# EAGLE design DACBRDV2 (EAGLE 5.07)
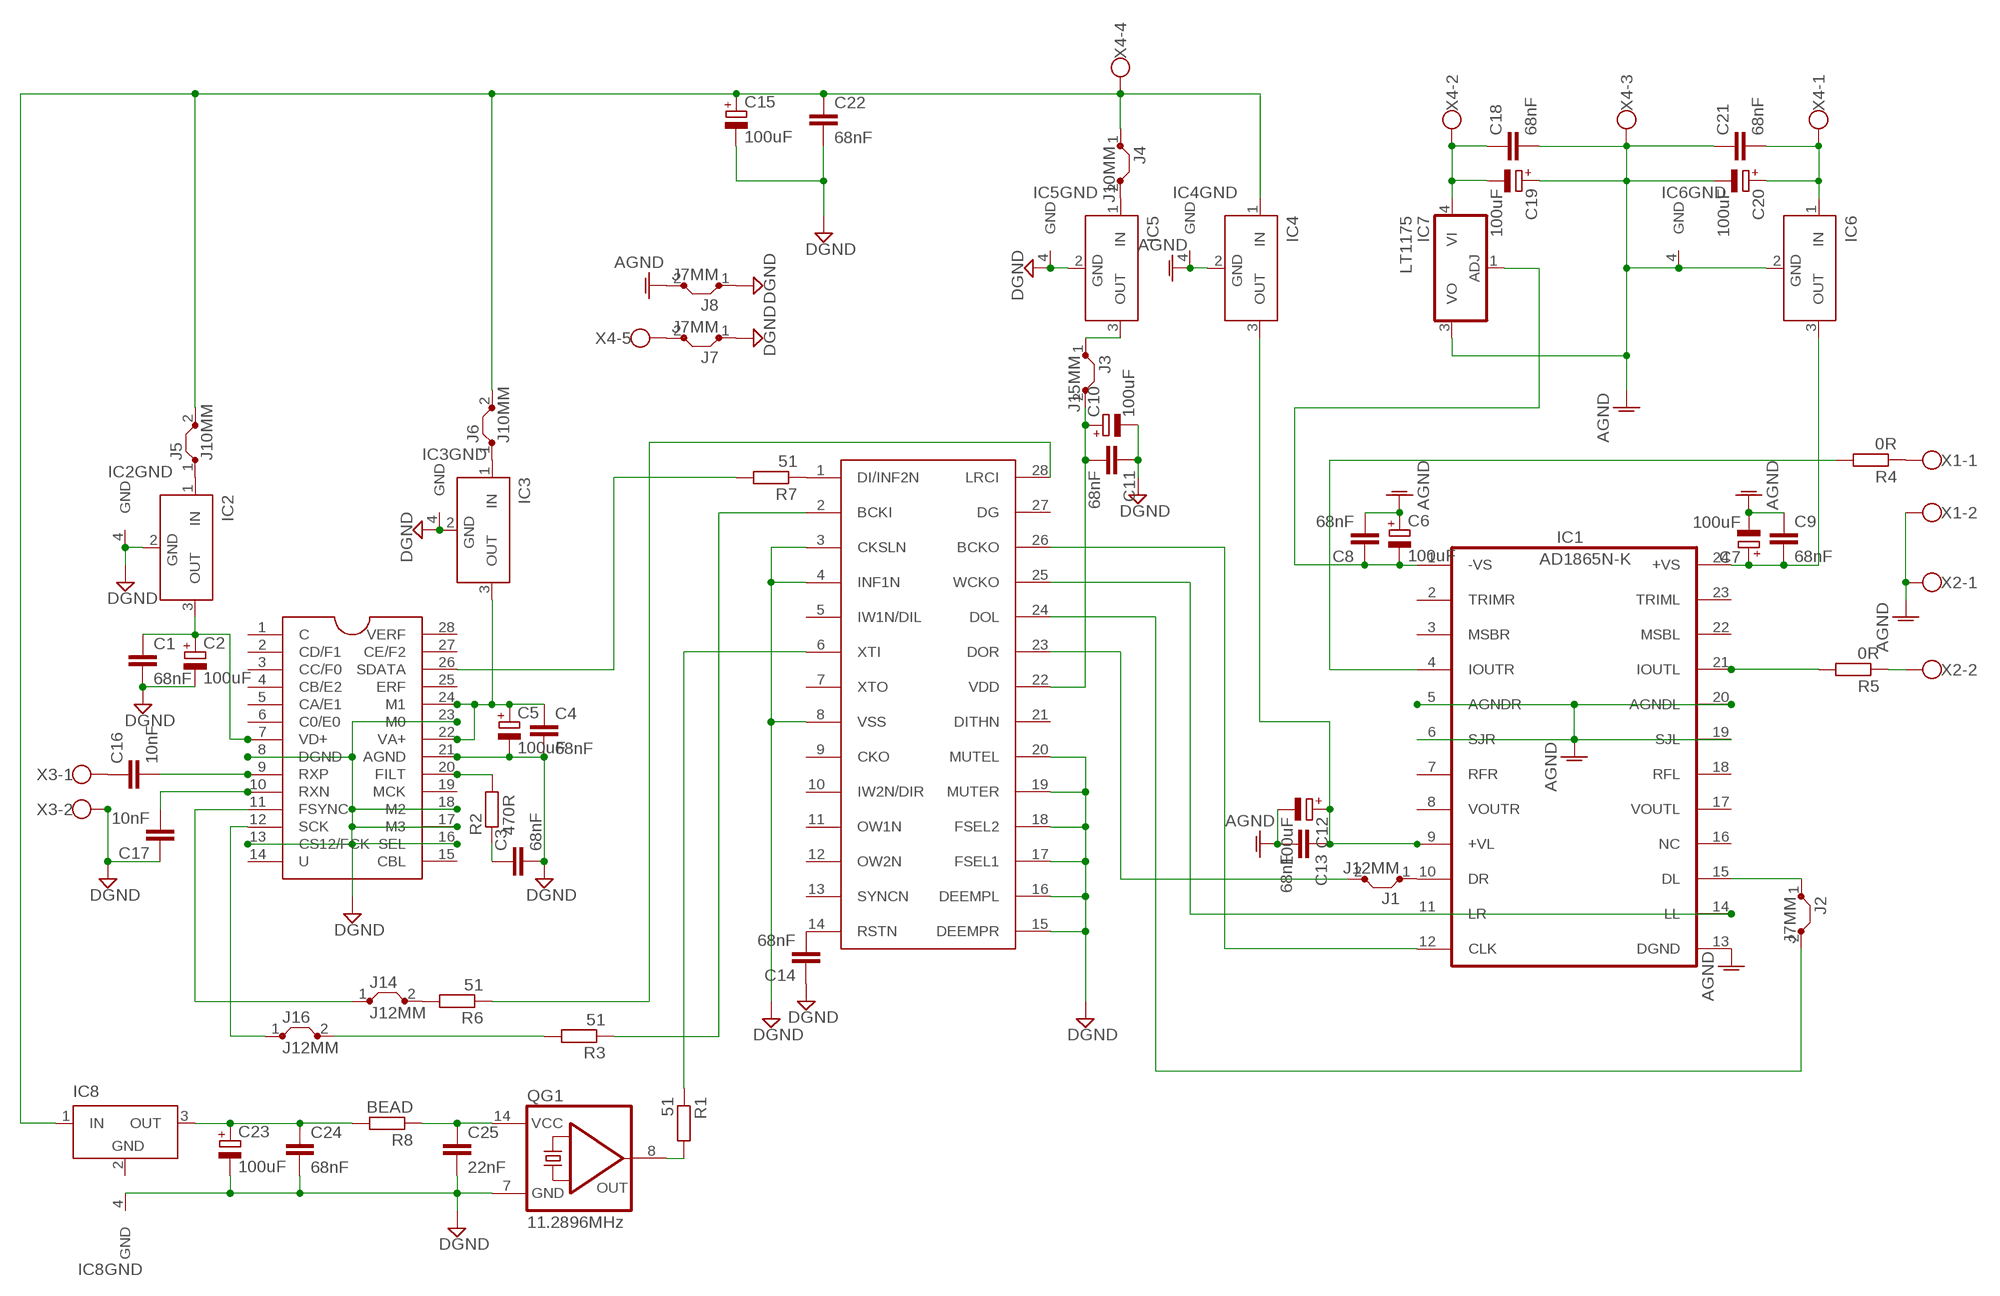
[diagram p0: schematic, sheet 1]

## Parts
C1  68nF  C-EU050-035X075  [C050-035X075]
C2  100uF  CPOL-EUE5-10.5  [E5-10,5]
C3  68nF  C-EU050-075X075  [C050-075X075]
C4  68nF  C-EU050-035X075  [C050-035X075]
C5  100uF  CPOL-EUE5-10.5  [E5-10,5]
C6  100uF  CPOL-EUE5-10.5  [E5-10,5]
C7  100uF  CPOL-EUE5-10.5  [E5-10,5]
C8  68nF  C-EU050-035X075  [C050-035X075]
C9  68nF  C-EU050-035X075  [C050-035X075]
C10  100uF  CPOL-EUE5-10.5  [E5-10,5]
C11  68nF  C-EU050-035X075  [C050-035X075]
C12  100uF  CPOL-EUE5-10.5  [E5-10,5]
C13  68nF  C-EU050-035X075  [C050-035X075]
C14  68nF  C-EU050-035X075  [C050-035X075]
C15  100uF  CPOL-EUE5-10.5  [E5-10,5]
C16  10nF  C-EU050-055X075  [C050-055X075]
C17  10nF  C-EU050-055X075  [C050-055X075]
C18  68nF  C-EU050-035X075  [C050-035X075]
C19  100uF  CPOL-EUE5-10.5  [E5-10,5]
C20  100uF  CPOL-EUE5-10.5  [E5-10,5]
C21  68nF  C-EU050-035X075  [C050-035X075]
C22  68nF  C-EU050-035X075  [C050-035X075]
C23  100uF  CPOL-EUE5-10.5  [E5-10,5]
C24  68nF  C-EU050-035X075  [C050-035X075]
C25  22nF  C-EU050-035X075  [C050-035X075]
IC1  AD1865N-K  AD1865  [DIL24-6]
IC2  LT1129CST5  [SOT223]
IC3  LT1129CST5  [SOT223]
IC4  LT1129CST5  [SOT223]
IC5  LT1129CST5  [SOT223]
IC6  LT1129CST5  [SOT223]
IC7  LT1175  337IMP  [SOT223]
IC8  LT1129CST5  [SOT223]
J1  J12MM  [12]
J2  J7MM  [07]
J3  J15MM  [15]
J4  J10MM  [10]
J5  J10MM  [10]
J6  J10MM  [10]
J7  J7MM  [07]
J8  J7MM  [07]
J14  J12MM  [12]
J16  J12MM  [12]
QG1  11.2896MHz  QG5860  [DIL14S]
R1  51  R-EU_0204/7  [0204/7]
R2  470R  R-EU_0204/7  [0204/7]
R3  51  R-EU_0204/7  [0204/7]
R4  0R  R-EU_0309/12  [0309/12]
R5  0R  R-EU_0309/12  [0309/12]
R6  51  R-EU_0207/12  [0207/12]
R7  51  R-EU_0207/12  [0207/12]
R8  BEAD  R-EU_0309/12  [0309/12]
U$1  CS8414  CS8414DIP  [DIL28]
U$2  SM5842  [DIL28]
X1  W237-02P  [W237-132]
X2  W237-02P  [W237-132]
X3  W237-02P  [W237-132]
X4  W237-05P  [W237-5P]

## Nets
AGND: C6.+ C7.- C8.2 C9.1 C12.- C13.2 C18.2 C19.+ C20.- C21.1 IC1.5(AGNDR) IC1.6(SJR) IC1.13(DGND) IC1.19(SJL) IC1.20(AGNDL) IC4.2(GND) IC4.4(GND) IC6.2(GND) IC6.4(GND) IC7.3(VO) J8.2 X1.2 X2.1 X4.3
DGND: C1.2 C2.- C3.2 C4.2 C5.- C10.- C11.1 C14.1 C15.- C17.1 C22.2 C23.- C24.2 C25.2 IC2.2(GND) IC2.4(GND) IC3.2(GND) IC3.4(GND) IC5.2(GND) IC5.4(GND) IC8.4(GND) J7.1 J8.1 QG1.7(GND) U$1.8(DGND) U$1.13(CS12/FCK) U$1.16(SEL) U$1.17(M3) U$1.18(M2) U$1.21(AGND) U$1.23(M0) U$2.3(CKSLN) U$2.4(INF1N) U$2.8(VSS) U$2.15(DEEMPR) U$2.16(DEEMPL) U$2.17(FSEL1) U$2.18(FSEL2) U$2.19(MUTER) U$2.20(MUTEL) X3.2
N$1: R2.2 U$1.20(FILT)
N$2: IC1.11(LR) IC1.14(LL) U$2.25(WCKO)
N$3: C3.1 R2.1
N$5: C7.+ C9.2 IC1.24(+VS) IC6.3(OUT)
N$6: C10.+ C11.2 J3.2 U$2.22(VDD)
N$7: IC1.10(DR) J1.1
N$8: IC1.15(DL) J2.1
N$9: IC5.3(OUT) J3.1
N$10: IC5.1(IN) J4.2
N$11: J1.2 U$2.23(DOR)
N$12: J2.2 U$2.24(DOL)
N$14: IC1.12(CLK) U$2.26(BCKO)
N$15: C6.- C8.1 IC1.1(-VS) IC7.1(ADJ)
N$16: C15.+ C22.1 IC4.1(IN) IC8.1(IN) J4.1 J5.2 J6.2 X4.4
N$17: IC2.1(IN) J5.1
N$18: IC1.21(IOUTL) R5.2
N$19: R7.2 U$1.26(SDATA)
N$20: IC1.4(IOUTR) R4.2
N$21: R5.1 X2.2
N$22: R4.1 X1.1
N$23: C17.2 U$1.10(RXN)
N$24: C16.2 U$1.9(RXP)
N$25: C16.1 X3.1
N$26: C12.+ C13.1 IC1.9(+VL) IC4.3(OUT)
N$27: R7.1 U$2.1(DI/INF2N)
N$28: R1.1 U$2.6(XTI)
N$29: C25.1 QG1.14(VCC) R8.1
N$30: IC3.1(IN) J6.1
N$31: R3.1 U$2.2(BCKI)
N$32: C4.1 C5.+ IC3.3(OUT) U$1.22(VA+) U$1.24(M1)
N$33: J14.1 U$1.11(FSYNC)
N$34: J16.1 U$1.12(SCK)
N$35: R6.1 U$2.28(LRCI)
N$36: J16.2 R3.2
N$37: C14.2 U$2.14(RSTN)
N$38: J14.2 R6.2
N$39: C1.1 C2.+ IC2.3(OUT) U$1.7(VD+)
N$40: C18.1 C19.- IC7.4(VI) X4.2
N$41: QG1.8(OUT) R1.2
N$44: J7.2 X4.5
N$45: C20.+ C21.2 IC6.1(IN) X4.1
N$47: C23.+ C24.1 IC8.3(OUT) R8.2
Unconnected: IC1.2(TRIMR) IC1.3(MSBR) IC1.7(RFR) IC1.8(VOUTR) IC1.16(NC) IC1.17(VOUTL) IC1.18(RFL) IC1.22(MSBL) IC1.23(TRIML) U$1.1(C) U$1.2(CD/F1) U$1.3(CC/F0) U$1.4(CB/E2) U$1.5(CA/E1) U$1.6(C0/E0) U$1.14(U) U$1.15(CBL) U$1.19(MCK) U$1.25(ERF) U$1.27(CE/F2) U$1.28(VERF) U$2.5(IW1N/DIL) U$2.7(XTO) U$2.9(CKO) U$2.10(IW2N/DIR) U$2.11(OW1N) U$2.12(OW2N) U$2.13(SYNCN) U$2.21(DITHN) U$2.27(DG)

## Power pins joined to a net without a drawn wire
GND: IC8.2(GND)

## Library data of the parts
C1 C3 C4 C8 C9 C11 C13 C14 C16-C18 C21 C22 C24 C25 = resistor:C-EU: CAPACITOR, European symbol
C2 C5-C7 C10 C12 C15 C19 C20 C23 = resistor:CPOL-EU: POLARIZED CAPACITOR, European symbol
IC1 = pavouk:AD1865: Complete Dual 18-Bit 16xFS Audio DAC
IC2-IC6 IC8 = linear-technology:LT1129CST5: VOLTAGE REGULATOR with shutdown
IC7 = linear:*337: Negative VOLTAGE REGULATOR
J1-J8 J14 J16 = jumper:J: Bridge
QG1 = crystal:QG5860: CRYSTAL RESONATOR
R1-R8 = resistor:R-EU_: RESISTOR, European symbol
U$1 = cirrus-dar:CS8414: 24bit 96kHz Digital Audio Receiver
U$2 = burr-brown:SM5842
X1-X3 = con-wago-508:W237-02P: WAGO SREW CLAMP
X4 = con-wago-508:W237-05P: WAGO SREW CLAMP

## Board
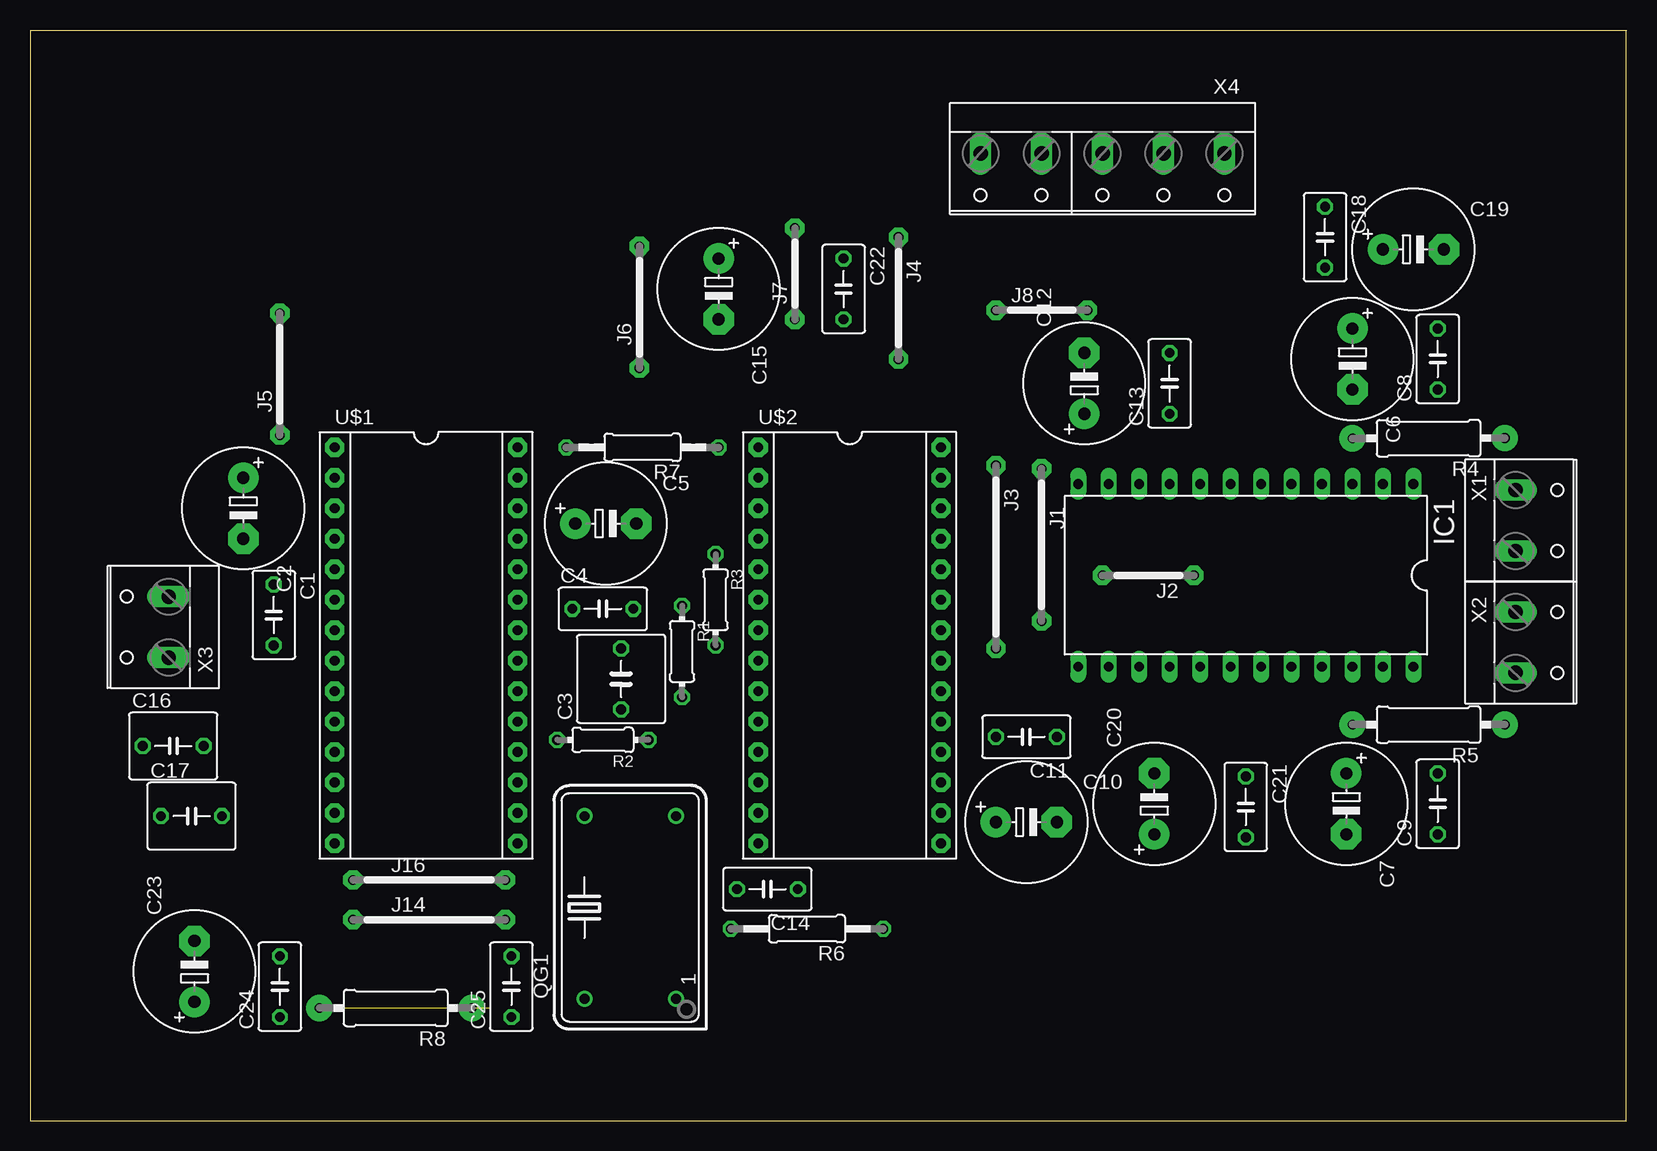
[diagram p1: board, top side]
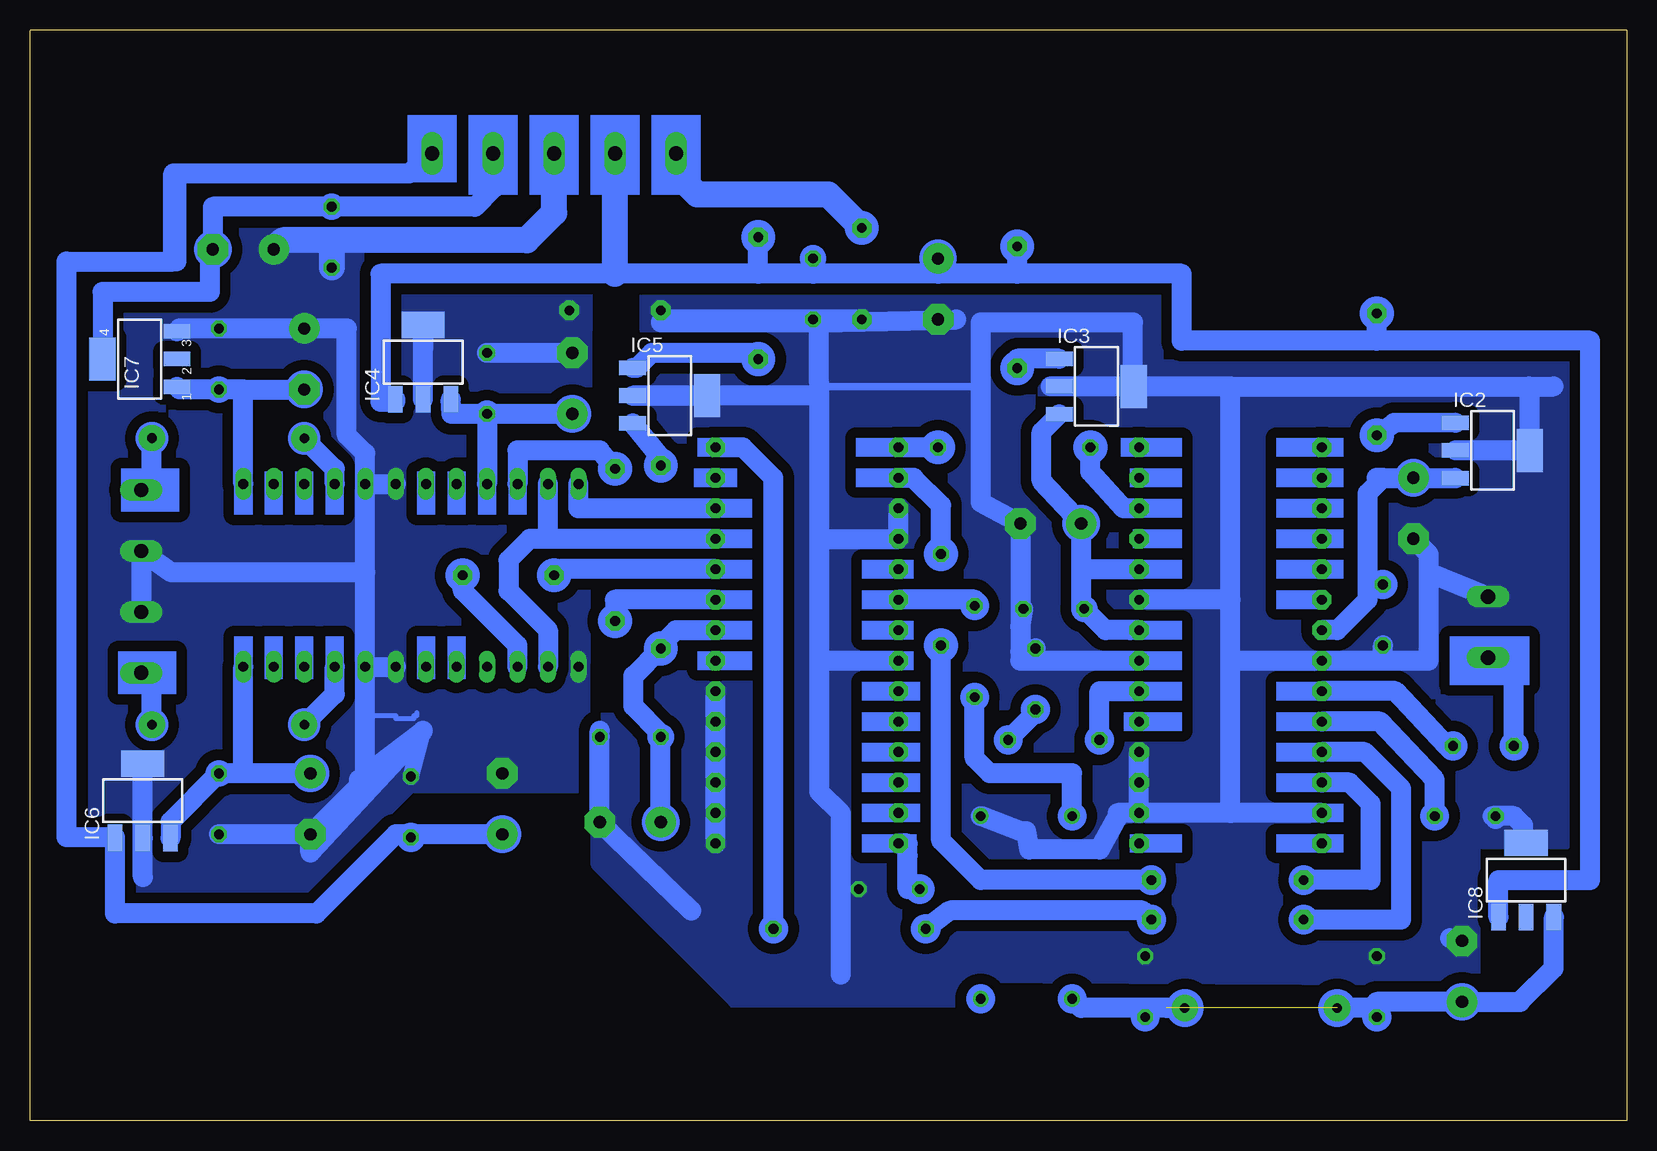
[diagram p2: board, bottom side, seen from below]

Size 133.1 x 90.93 mm. Coordinates in mm from the lower left corner, seen from the top.
Outline: 133.08,90.86 133.08,0 0,0 0,90.93 133.1,90.93
Copper layers (2*16): Route2 0.035mm / dielectric 0.15mm / Bottom 0.035mm
Design rules "default *": minimum track width 10mil, minimum drill 24mil, track to track 8mil, track to pad 8mil, pad to pad 8mil, via to via 8mil, smd to smd 8mil, copper to edge 40mil, drill to drill 8mil, minimum pad ring 10mil, minimum via ring 8mil, stop-mask expansion 4mil, vias tented up to drill 0mil, thermal gap 10mil

### Footprints (pad centres in the part's own frame; a part is rotated, then mirrored left to right if it is on the bottom)
C050-035X075 = drill 0.813 octagon: 1 -2.54,0; 2 2.54,0
E5-10,5 = drill 1.016 pad 2.54 round: + -2.54,0 | drill 1.016 pad 2.54 octagon: - 2.54,0
C050-075X075 = drill 0.813 octagon: 1 -2.54,0; 2 2.54,0
C050-055X075 = drill 0.813 octagon: 1 -2.54,0; 2 2.54,0
DIL24-6 = drill 0.813 long: 1 -13.97,-7.62; 2 -11.43,-7.62; 3 -8.89,-7.62; 4 -6.35,-7.62; 5 -3.81,-7.62; 6 -1.27,-7.62; 7 1.27,-7.62; 8 3.81,-7.62; 9 6.35,-7.62; 10 8.89,-7.62; 11 11.43,-7.62; 12 13.97,-7.62; 13 13.97,7.62; 14 11.43,7.62; 15 8.89,7.62; 16 6.35,7.62; 17 3.81,7.62; 18 1.27,7.62; 19 -1.27,7.62; 20 -3.81,7.62; 21 -6.35,7.62; 22 -8.89,7.62; 23 -11.43,7.62; 24 -13.97,7.62
SOT223 = smd 1.219 x 2.235: 1 -2.311,-3.099; 2 0,-3.099; 3 2.311,-3.099 | smd 3.6 x 2.2: 4 0,3.099
12 = drill 0.813 pad 1.6 octagon: 1 -6.35,0; 2 6.35,0
07 = drill 0.813 pad 1.6 octagon: 1 -3.81,0; 2 3.81,0
15 = drill 0.813 pad 1.6 octagon: 1 -7.62,0; 2 7.62,0
10 = drill 0.813 pad 1.6 octagon: 1 -5.08,0; 2 5.08,0
DIL14S = drill 0.813 round: 1 -7.62,-3.81; 7 7.62,-3.81; 8 7.62,3.81; 14 -7.62,3.81
0204/7 = drill 0.813 octagon: 1 -3.81,0; 2 3.81,0
0309/12 = drill 0.8 pad 2.184 round: 1 -6.35,0; 2 6.35,0
0207/12 = drill 0.813 octagon: 1 -6.35,0; 2 6.35,0
DIL28 = drill 0.813 pad 1.6 octagon: 1 -16.51,-7.62; 2 -13.97,-7.62; 3 -11.43,-7.62; 4 -8.89,-7.62; 5 -6.35,-7.62; 6 -3.81,-7.62; 7 -1.27,-7.62; 8 1.27,-7.62; 9 3.81,-7.62; 10 6.35,-7.62; 11 8.89,-7.62; 12 11.43,-7.62; 13 13.97,-7.62; 14 16.51,-7.62; 15 16.51,7.62; 16 13.97,7.62; 17 11.43,7.62; 18 8.89,7.62; 19 6.35,7.62; 20 3.81,7.62; 21 1.27,7.62; 22 -1.27,7.62; 23 -3.81,7.62; 24 -6.35,7.62; 25 -8.89,7.62; 26 -11.43,7.62; 27 -13.97,7.62; 28 -16.51,7.62
W237-132 = drill 1.194 long: 1 -2.54,-0.635; 2 2.54,-0.635
W237-5P = drill 1.194 long: 1 -10.16,-0.635; 2 -5.08,-0.635; 3 0,-0.635; 4 5.08,-0.635; 5 10.16,-0.635

### Placement (x,y rotation side)
C1  20.32,42.16 270 top
C2  17.78,51.05 270 top
C3  49.28,36.83 90 top
C4  47.75,42.67 0 top
C5  48.01,49.78 0 top
C6  110.24,63.5 270 top
C7  109.73,26.42 270 top
C8  117.35,63.5 90 top
C9  117.35,26.42 90 top
C10  83.06,24.89 0 top
C11  83.06,32 180 top
C12  87.88,61.47 90 top
C13  95,61.47 90 top
C14  61.47,19.3 180 top
C15  57.4,69.34 270 top
C16  11.94,31.24 0 top
C17  13.46,25.4 0 top
C18  107.95,73.66 270 top
C19  115.32,72.64 0 top
C20  93.73,26.42 90 top
C21  101.35,26.16 270 top
C22  67.82,69.34 270 top
C23  13.72,12.45 90 top
C24  20.83,11.18 90 top
C25  40.13,11.18 90 top
IC1  101.35,45.47 180 top
IC2  11.18,55.88 270 bottom
IC3  44.2,61.21 270 bottom
IC4  100.33,63.25 0 bottom
IC5  79.76,60.45 270 bottom
IC6  123.7,26.67 0 bottom
IC7  123.95,63.5 90 bottom
IC8  8.38,20.07 0 bottom
J1  84.33,48.01 270 top
J2  93.22,45.47 180 top
J3  80.52,46.99 270 top
J4  72.39,68.58 270 top
J5  20.83,62.23 90 top
J6  50.8,67.82 90 top
J7  63.75,70.61 90 top
J8  84.33,67.56 0 top
J14  33.27,16.76 0 top
J16  33.27,20.07 0 top
QG1  50.04,17.78 90 top
R1  54.36,39.12 270 top
R2  47.75,31.75 180 top
R3  57.15,43.43 270 top
R4  116.59,56.9 180.1 top
R5  116.59,33.02 180 top
R6  64.77,16 180 top
R7  51.05,56.13 180 top
R8  30.48,9.4 180 top
U$1  33.02,39.62 270 top
U$2  68.33,39.62 270 top
X1  124.46,50.04 270 top
X2  124.46,39.88 270 top
X3  10.92,41.15 90 top
X4  89.41,80.01 180 top

### Tracks (layer width: path | path; a pad name or v marks a point on that pad's centre or on a via)
AGND
  Bottom 0.406: 100.84,34.04 100.84,33.78 101.09,33.78 101.09,33.53 102.62,33.53 102.62,33.78 105.16,33.78 105.66,33.78
  Bottom 1.422: C21.1 100.33,32.51
  Bottom 1.676: IC1.5 IC1.6 | IC1.20 105.16,45.72 | 105.16,45.72 IC1.5 | IC1.20 IC1.19 | IC1.5 105.16,55.63 106.68,57.15 106.68,66.04 C6.+ C8.2 120.62,66.04 IC7.3 | C7.- C9.1 | X2.1 X1.2 121.28,45.72 105.16,45.72 | 105.16,28.45 C7.- | 105.16,28.45 105.16,33.78 IC1.20 | IC6.4 IC6.2 123.7,20.32 | C7.- 109.73,22.35 100.33,32.51 105.66,28.45 105.16,28.45 | C12.- C13.2 | IC4.2 IC4.4 100.33,64.26
  Bottom 2.184: X4.3 89.41,75.69 91.69,73.41 107.95,73.41 | 107.95,73.41 C18.2 | C19.+ 112.01,73.41 107.95,73.41
  pour Bottom (isolate 0.889, no thermals): 86.61,69.6 86.61,69.34 86.87,27.69 101.35,27.69 109.73,19.3 128.27,19.3 128.78,74.17 105.66,74.17 105.66,69.85
DGND
  Bottom 0.61: 53.85,61.21 67.06,61.21 67.31,61.47
  Bottom 1.676: 33.02,25.65 33.02,38.35 | 33.02,25.65 U$1.16 | U$1.16 U$1.17 U$1.18 | U$1.13 33.02,25.65 | 33.02,38.35 U$1.8 20.32,38.35 | 20.32,38.35 C1.2 | 16.51,45.72 16.51,38.35 20.32,38.35 | 16.51,45.72 X3.2 | C2.- 16.51,47.24 16.51,45.72 | U$2.15 U$2.16 U$2.17 U$2.18 U$2.19 U$2.20 | 67.31,38.35 U$2.8 | U$1.16 42.42,25.65 42.42,25.4 43.94,22.61 49.78,22.61 50.04,24.13 50.55,24.13 QG1.7 | 67.31,48.51 67.31,38.35 | 67.31,48.51 U$2.4 U$2.3 | 67.31,38.35 67.31,27.43 65.53,25.65 65.53,12.19 | 77.98,17.53 C10.- C11.1 85.6,32.51 | 67.31,60.45 67.31,48.51 | 67.31,60.45 67.31,61.47 67.31,66.55 | 50.55,39.12 C3.2 | 50.55,41.15 C4.2 | 50.55,41.15 C5.- 53.85,51.56 53.85,61.21 53.85,66.55 41.15,66.55 41.15,61.21 | 50.55,41.15 50.55,39.12 | 50.55,39.12 50.55,38.35 U$1.21 | 67.31,66.55 67.56,66.55 | IC5.4 IC5.2 67.31,60.45 | IC2.4 8.13,55.88 | 8.13,55.88 IC2.2 | 8.13,55.88 8.25,55.75 | 33.02,43.43 33.02,61.21 | 33.02,38.35 33.02,43.43 | 8.13,61.21 8.13,55.12 | 33.02,61.21 8.13,61.21 | 8.13,61.21 6.1,61.21 | 33.02,61.21 41.15,61.21 | 41.15,61.21 48.01,61.21 | 67.31,66.55 55.88,66.8 | 67.56,66.55 80.52,66.55 | 67.56,66.55 C22.2 | C15.- 57.15,66.8 | J7.1 79.76,66.8 | 33.02,43.43 U$1.23 | IC8.4 8.64,23.42 8.64,24.64 9.4,25.4 C17.1 | C17.1 11.18,25.4 10.92,25.15 C17.1 | C23.- 14.73,15.24
  pour Bottom (isolate 0.889, rank 5, no thermals): 5.08,62.99 5.08,23.11 12.7,23.11 12.7,11.68 55.88,11.94 55.88,9.91 74.42,9.91 85.85,21.34 85.85,33.53 81.53,33.53 81.79,68.83 39.12,68.58 39.12,62.99
N$1
  Bottom 1.676: U$1.20 43.94,35.81 R2.2
N$2
  Bottom 1.676: U$2.25 89.92,48.51 | 89.92,48.51 IC1.11 | IC1.14 89.92,40.89 93.22,44.2 93.22,46.74 91.44,48.51 89.92,48.51
N$3
  Bottom 1.676: C3.1 49.28,34.04 R2.1
N$5
  Bottom 1.676: C7.+ 115.32,28.96 | 115.32,28.96 C9.2 121.39,24.92 IC6.3 | 115.32,28.96 IC1.24
N$6
  Bottom 1.676: C10.+ C11.2 80.52,32.26 82.8,34.54 82.8,37.08 J3.2 80.52,39.62 79.25,40.89 U$2.22
N$7
  Bottom 1.676: IC1.10 92.46,55.88 85.6,55.88 J1.1
N$8
  Bottom 1.676: IC1.15 92.46,39.62 97.03,44.2 J2.1
N$9
  Bottom 1.676: IC5.3 80.52,55.3 J3.1
N$10
  Bottom 1.676: J4.2 72.9,64.01 81.28,64.01 82.53,62.76 IC5.1
N$11
  Bottom 1.676: U$2.23 84.33,43.43 J1.2
N$12
  Bottom 1.676: U$2.24 88.9,45.97 J2.2
N$14
  Bottom 1.676: U$2.26 87.38,51.05 IC1.12
N$15
  Bottom 1.676: IC1.1 115.32,60.96 | 115.32,60.96 C8.1 120.62,60.96 IC7.1 | 115.32,60.96 C6.-
N$16
  Bottom 1.676: 20.83,65.02 J5.2 | 20.83,65.02 37.08,65.02 37.08,70.61 50.8,70.61 | 50.8,70.61 57.4,70.61 | 57.4,70.61 67.82,70.61 | 67.82,70.61 72.39,70.61 | 72.39,70.61 84.33,70.61 103.89,70.61 103.89,59.94 102.64,59.97 IC4.1 | 50.8,70.61 J6.2 | 72.39,70.61 J4.1 | 57.4,70.61 C15.+ | 67.82,70.61 C22.1 | 20.83,65.02 3.05,65.02 3.05,20.07 10.69,20.07 IC8.1
  Bottom 2.184: 84.33,70.61 X4.4
N$17
  Bottom 1.676: IC2.1 19.38,58.17 J5.1
N$18
  Bottom 1.676: R5.2 107.7,35.56 IC1.21
N$19
  Bottom 1.676: U$1.26 41.91,51.05 44.7,54.1 R7.2
N$20
  Bottom 1.676: IC1.4 107.7,54.34 R4.2
N$21
  Bottom 1.676: R5.1 122.94,37.21 X2.2
N$22
  Bottom 1.676: R4.1 122.94,52.7 X1.1
N$23
  Bottom 1.676: U$1.10 20.57,33.27 16,28.45 C17.2
N$24
  Bottom 1.676: U$1.9 19.3,35.81 14.99,31.24 C16.2
N$25
  Bottom 1.676: X3.1 9.4,37.97 C16.1
N$26
  Bottom 1.676: C12.+ C13.1 | C13.1 IC1.9 | IC4.3 97.97,58.93 C13.1
N$27
  Bottom 1.676: R7.1 U$2.1
N$28
  Bottom 1.676: R1.1 54.36,43.43 U$2.6
N$29
  Bottom 1.676: R8.1 40.13,9.4 | 40.13,9.4 C25.1 | QG1.14 45.47,9.4 40.13,9.4
N$30
  Bottom 1.676: IC3.1 50.8,63.52 J6.1
N$31
  Bottom 1.676: U$2.2 59.44,53.59 57.15,51.31 R3.1
N$32
  Bottom 1.676: 45.47,45.97 U$1.24 | 45.47,45.97 C5.+ 48.77,53.34 48.77,57.43 IC3.3 | 41.4,40.89 U$1.22 43.43,40.89 C4.1 45.47,42.93 45.47,45.97
N$33
  Bottom 1.676: J14.1 18.8,16.76 18.8,27.69 21.84,30.73 U$1.11
N$34
  Bottom 1.676: J16.1 21.34,20.07 21.34,26.42 23.11,28.19 U$1.12
N$35
  Bottom 1.676: U$2.28 73.66,56.13 71.12,53.59 R6.1
N$36
  Bottom 1.676: R3.2 57.15,23.37 53.85,20.07 J16.2
N$37
  Bottom 1.676: C14.2 59.94,19.3 59.94,22.1 59.94,23.11 U$2.14
N$38
  Bottom 1.676: J14.2 40.39,17.53 56.39,17.53 R6.2
N$39
  Bottom 1.676: U$1.7 24.13,40.89 21.59,43.43 21.59,44.7 | 20.32,53.59 21.59,52.32 21.59,44.7 | 20.32,53.59 18.29,53.59 C2.+ 14.3,53.59 IC2.3 | 21.59,44.7 C1.1 | 20.32,53.59 20.83,53.59
N$40
  Bottom 1.676: IC7.4 127.05,69.09 118.11,69.09 118.11,72.64 C19.- 117.86,76.2 C18.1 96.01,76.2 94.49,77.72 X4.2
N$41
  Bottom 1.676: QG1.8 46.23,28.96 53.09,28.96 54.36,30.23 R1.2
N$44
  Bottom 2.184: J7.2 66.55,77.22 77.47,77.22 79.25,78.99 X4.5
N$45
  Bottom 1.676: X4.1 101.47,78.99 120.9,78.99 | 120.9,78.99 121.16,78.99 121.16,71.63 130.05,71.63 130.05,23.62 126.01,23.62 IC6.1 126.01,17.27 109.22,17.27 102.62,23.88 101.35,23.88 | C20.+ 101.35,23.88 | 101.35,23.88 C21.2 | 120.9,78.99 120.9,71.63
N$47  (1 unrouted)
  Bottom 1.676: IC8.3 6.1,14.91 6.1,12.7 8.89,9.91 C23.+ 20.83,9.91 20.83,9.4 | 20.83,9.4 C24.1 | 20.83,9.4 R8.2 | 38.35,9.4 45.47,9.4 46.23,9.91
(copper drawn outside any net)
  shapes: Bottom area x116, Bottom circle x74